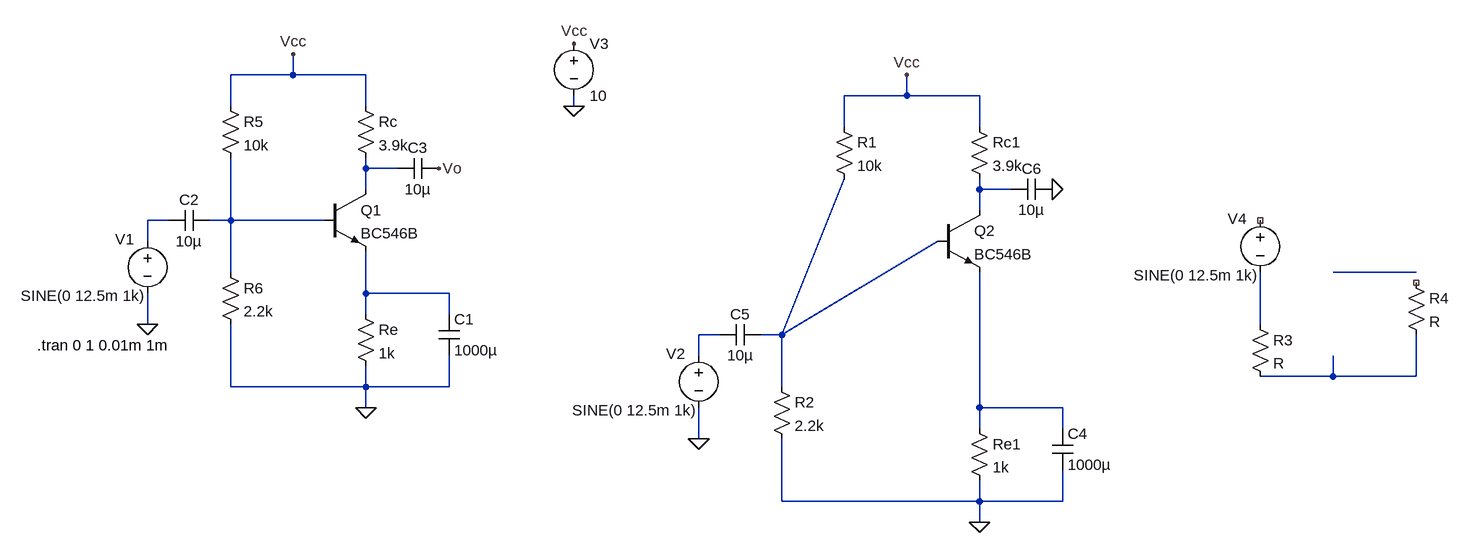
[diagram p0: schematic Project - EletronicaEC.asc]
Project - EletronicaEC.asc, the LTspice schematic file:
Version 4
SHEET 1 2136 680
WIRE 352 -192 352 -224
WIRE 352 -192 256 -192
WIRE 464 -192 352 -192
WIRE 1296 -160 1296 -192
WIRE 1296 -160 1200 -160
WIRE 1408 -160 1296 -160
WIRE 256 -144 256 -192
WIRE 464 -144 464 -192
WIRE 784 -144 784 -160
WIRE 1200 -112 1200 -160
WIRE 1408 -112 1408 -160
WIRE 464 -48 464 -64
WIRE 512 -48 464 -48
WIRE 464 -16 464 -48
WIRE 1408 -16 1408 -32
WIRE 1456 -16 1408 -16
WIRE 1408 16 1408 -16
WIRE 160 32 128 32
WIRE 256 32 256 -64
WIRE 256 32 224 32
WIRE 400 32 256 32
WIRE 128 64 128 32
WIRE 256 112 256 32
WIRE 2080 112 1952 112
WIRE 464 144 464 80
WIRE 592 144 464 144
WIRE 464 176 464 144
WIRE 592 176 592 144
WIRE 128 192 128 144
WIRE 1840 192 1840 112
WIRE 1008 208 976 208
WIRE 1104 208 1200 -32
WIRE 1104 208 1344 64
WIRE 1104 208 1072 208
WIRE 976 240 976 208
WIRE 1952 272 1952 240
WIRE 1952 272 1840 272
WIRE 2080 272 2080 208
WIRE 2080 272 1952 272
WIRE 256 288 256 192
WIRE 464 288 464 256
WIRE 464 288 256 288
WIRE 592 288 592 240
WIRE 592 288 464 288
WIRE 1104 288 1104 208
WIRE 464 320 464 288
WIRE 1408 320 1408 112
WIRE 1536 320 1408 320
WIRE 1408 352 1408 320
WIRE 1536 352 1536 320
WIRE 976 368 976 320
WIRE 1104 464 1104 368
WIRE 1408 464 1408 432
WIRE 1408 464 1104 464
WIRE 1536 464 1536 416
WIRE 1536 464 1408 464
WIRE 1408 496 1408 464
FLAG 128 192 0
FLAG 464 320 0
FLAG 784 -144 0
FLAG 784 -240 Vcc
FLAG 352 -224 Vcc
FLAG 976 368 0
FLAG 1408 496 0
FLAG 1296 -192 Vcc
FLAG 1520 -16 0
FLAG 576 -48 Vo
SYMBOL voltage 128 48 R0
WINDOW 0 -50 13 Left 2
WINDOW 3 -195 100 Left 2
WINDOW 123 0 0 Left 2
WINDOW 39 0 0 Left 2
SYMATTR InstName V1
SYMATTR Value SINE(0 12.5m 1k)
SYMBOL npn 400 -16 R0
SYMATTR InstName Q1
SYMATTR Value BC546B
SYMBOL res 448 -160 R0
SYMATTR InstName Rc
SYMATTR Value 3.9k
SYMBOL res 448 160 R0
SYMATTR InstName Re
SYMATTR Value 1k
SYMBOL res 240 -160 R0
SYMATTR InstName R5
SYMATTR Value 10k
SYMBOL res 240 96 R0
SYMATTR InstName R6
SYMATTR Value 2.2k
SYMBOL cap 576 176 R0
SYMATTR InstName C1
SYMATTR Value 1000µ
SYMBOL cap 224 16 R90
WINDOW 0 0 32 VBottom 2
WINDOW 3 32 32 VTop 2
SYMATTR InstName C2
SYMATTR Value 10µ
SYMBOL cap 576 -64 R90
WINDOW 0 0 32 VBottom 2
WINDOW 3 32 32 VTop 2
SYMATTR InstName C3
SYMATTR Value 10µ
SYMBOL voltage 784 -256 R0
WINDOW 123 0 0 Left 2
WINDOW 39 0 0 Left 2
SYMATTR InstName V3
SYMATTR Value 10
SYMBOL voltage 976 224 R0
WINDOW 0 -50 13 Left 2
WINDOW 3 -195 100 Left 2
WINDOW 123 0 0 Left 2
WINDOW 39 0 0 Left 2
SYMATTR InstName V2
SYMATTR Value SINE(0 12.5m 1k)
SYMBOL npn 1344 16 R0
SYMATTR InstName Q2
SYMATTR Value BC546B
SYMBOL res 1392 -128 R0
SYMATTR InstName Rc1
SYMATTR Value 3.9k
SYMBOL res 1392 336 R0
SYMATTR InstName Re1
SYMATTR Value 1k
SYMBOL res 1184 -128 R0
SYMATTR InstName R1
SYMATTR Value 10k
SYMBOL res 1088 272 R0
SYMATTR InstName R2
SYMATTR Value 2.2k
SYMBOL cap 1520 352 R0
SYMATTR InstName C4
SYMATTR Value 1000µ
SYMBOL cap 1072 192 R90
WINDOW 0 0 32 VBottom 2
WINDOW 3 32 32 VTop 2
SYMATTR InstName C5
SYMATTR Value 10µ
SYMBOL cap 1520 -32 R90
WINDOW 0 0 32 VBottom 2
WINDOW 3 32 32 VTop 2
SYMATTR InstName C6
SYMATTR Value 10µ
SYMBOL res 1824 176 R0
SYMATTR InstName R3
SYMBOL voltage 1840 16 R0
WINDOW 0 -50 13 Left 2
WINDOW 3 -195 100 Left 2
WINDOW 123 0 0 Left 2
WINDOW 39 0 0 Left 2
SYMATTR InstName V4
SYMATTR Value SINE(0 12.5m 1k)
SYMBOL res 2064 112 R0
SYMATTR InstName R4
TEXT -42 224 Left 2 !.tran 0 1 0.01m 1m

The netlist it stands for:
* Project - EletronicaEC.asc
V1 N003 0 SINE(0 12.5m 1k)
Q1 N001 N004 N006 0 BC546B
Rc Vcc N001 3.9k
Re N006 0 1k
R5 Vcc N004 10k
R6 N004 0 2.2k
C1 N006 0 1000µ
C2 N004 N003 10µ
C3 Vo N001 10µ
V3 Vcc 0 10
V2 N008 0 SINE(0 12.5m 1k)
Q2 N002 N009 N011 0 BC546B
Rc1 Vcc N002 3.9k
Re1 N011 0 1k
R1 Vcc N009 10k
R2 N009 0 2.2k
C4 N011 0 1000µ
C5 N009 N008 10µ
C6 0 N002 10µ
R3 N007 N010 R
V4 NC_01 N007 SINE(0 12.5m 1k)
R4 NC_02 N010 R
.model NPN NPN
.model PNP PNP
.lib standard.bjt
.tran 0 1 0.01m 1m
.backanno
.end